# Altium project Pole Position.PrjPCB
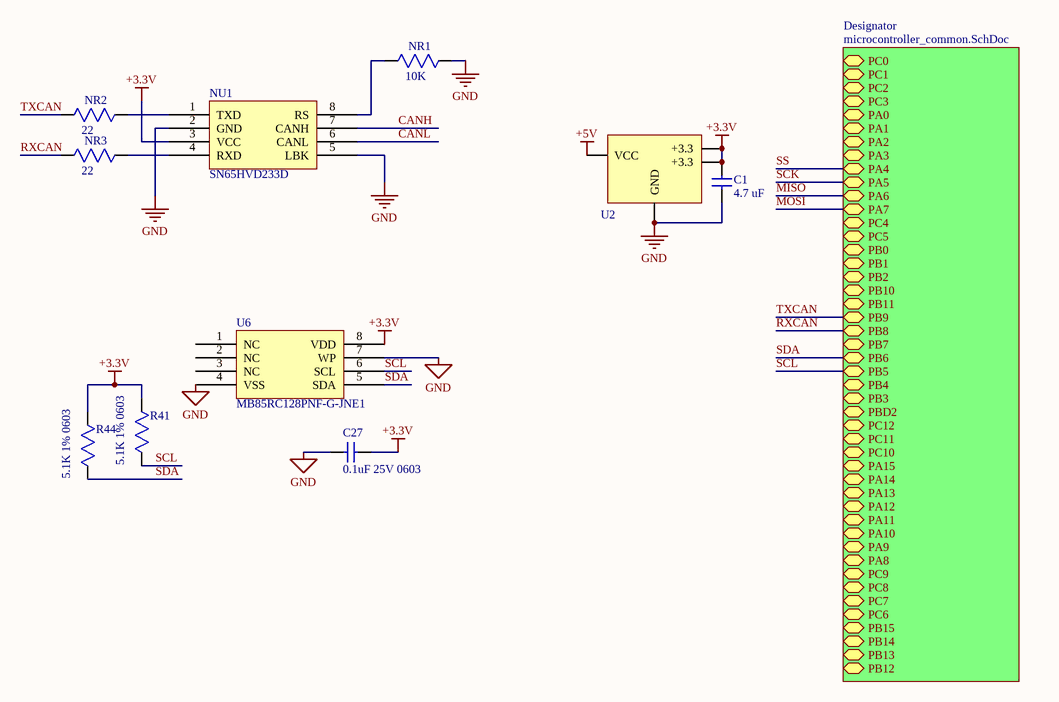
[diagram p0: Pole Position.SchDoc]
1 sheet, 10 parts. Net scope: hierarchical (ports join the sheet entries above them; power ports are global).
Board file: Pole Position.PcbDoc

## Sheet Pole Position.SchDoc
size A

### Parts
C1  value 4.7 uF  [0805_Capacitor]  (hidden comment: CAP 4.7uF)
C27  value 0.1uF 25V 0603  [0603_cap]  (hidden comment: CAP 0603)
NR1  value 10K  [0805]  (hidden comment: R_0805_10k_1%)
NR2  value 22  [0805]  (hidden comment: R_0805_22_1%)
NR3  value 22  [0805]  (hidden comment: R_0805_22_1%)
NU1  Part Number: SN65HVD233D  [SOIC127P600X175-8N]  (hidden comment: U_SN65HVD233D)
R41  value 5.1K 1% 0603  [0603_res]  (hidden comment: RES 0603)
R44  value 5.1K 1% 0603  [0603_res]  (hidden comment: RES 0603)
U2  ZLDO1117G33TA  [SOT223-3]  (value not drawn)
U6  MB85RC128PNF-G-JNE1  [SOIC127P600X175-8N]

### Sub-sheets
Designator = microcontroller_common.SchDoc (file not in this document): PC0, PC1, PC2, PC3, PA0, PA1, PA2, PA3, PA4, PA5, PA6, PA7, PC4, PC5, PB0, PB1, PB2, PB10, PB11, PB9, PB8, PB7, PB6, PB5, PB4, PB3, PBD2, PC12, PC11, PC10, PA15, PA14, PA13, PA12, PA11, PA10, PA9, PA8, PC9, PC8, PC7, PC6, PB15, PB14, PB13, PB12

### Nets
+3.3V: C1.1 C27.1 NU1.3(VCC) R41.1 R44.1 U2.2(+3.3) U2.4(+3.3) U6.8(VDD)
+5V: U2.3(VCC)
GND: C1.2 C27.2 NR1.1 NU1.2(GND) NU1.5(LBK) U2.1(GND) U6.4(VSS) U6.7(WP)
CANH: NU1.7(CANH)
CANL: NU1.6(CANL)
MISO: sheet Designator/PA6
MOSI: sheet Designator/PA7
RXCAN: NR3.2 ; sheet Designator/PB8
SCK: sheet Designator/PA5
SCL: R41.2 U6.6(SCL) ; sheet Designator/PB5
SDA: R44.2 U6.5(SDA) ; sheet Designator/PB6
SS: sheet Designator/PA4
TXCAN: NR2.2 ; sheet Designator/PB9
NetNR1_2: NR1.2 NU1.8(RS)
NetNR2_1: NR2.1 NU1.1(TXD)
NetNR3_1: NR3.1 NU1.4(RXD)

Not connected (* = marked no-connect by the designer): U6 1(NC) 2(NC) 3(NC)

### Library data of the parts
C1 = C_0805_4.7uF: CAP CER 4.7UF 50V X5R 10% 0805; Manufacturer: TDK Corp; Manufacturer PN: C2012X5R1H475K; SVP Creator: Matt Rogge; Package: 0805; Known Distributors: Digikey; ComponentLink1Description: Datasheet; ComponentLink1URL: http://www.tdk.com/pdf/general_B11.pdf; Price: .80
C27 = C_0603: CAP CER 0.1UF 25V X7R 0603; Supplier Part Number 1: 490-1524-1-ND; Supplier 1: Digi-Key
NR1 = R_0805_10K_1%: RES 10K OHM 1/8W 1% 0805 SMD; Power Rating: .125W; SVP Creator: Jonathan Nutzmann; Package: 0805; Known Distributor: Digikey; ComponentLink1Description: Datasheet
NR2 NR3 = R_0805_22_1%: RES 22 OHM 1/8W 1% 0805 SMD; Power Rating: .125W; SVP Creator: Jonathan Nutzmann; Package: 0805; Known Distributor: Digikey; ComponentLink1Description: Datasheet
NU1 = U_SN65HVD233D: IC 3.3V CAN TXRX 8-SOIC; Manufacturer: Texas Instruments
R41 R44 = R_0603: RES 5.1K 1% 0603; Supplier 1: Digi-Key; Supplier Part Number 1: 311-5.10KCRCT-ND
U2 = U_ZLDO1117G33TA: IC REG LDO 1A 3.3V SOT223-3; Manufacturer: Diodes Inc; SVP Creator: Jonathan Nutzmann; Known Distributors: Digikey; Manufacturer PN: ZLDO1117G33TA; ComponentLink1Description: Datasheet; ComponentLink1URL: SVN Datasheet URL; Price: 0.61
U6 = U_MB85RC16PNF-G-JNE1: IC FRAM 128KBIT 400KHZ 8SOP; Manufacturer: Fujitsu Semiconductor America Inc; Package: SOIC-8; Part Number: MB85RC128PNF-G-JNE1; Supplier 1: Digi-Key; Supplier Part Number 1: 865-1172-ND